# EAGLE design tk2 (EAGLE 8.4.3)

## Sheet 1 of 2
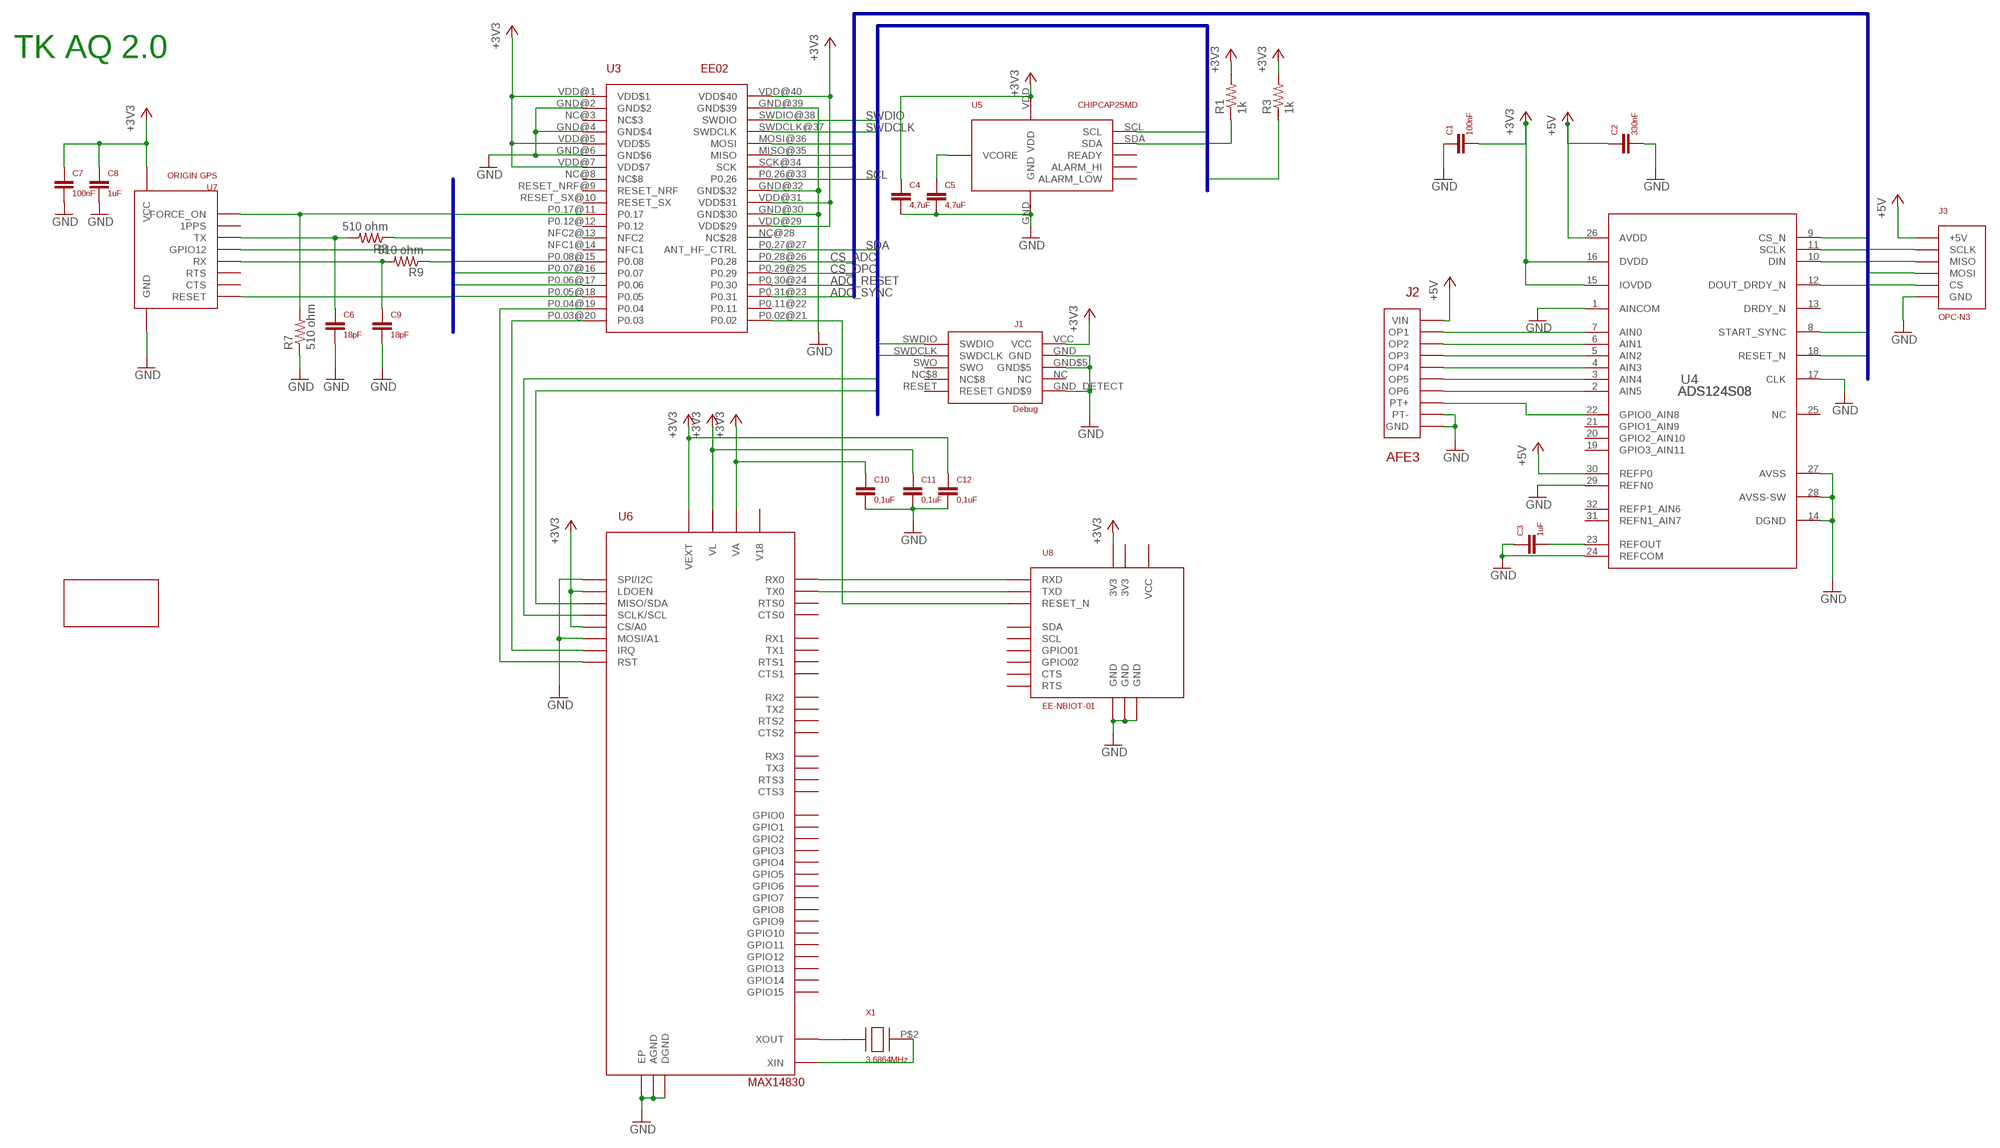
[diagram p0: schematic, sheet 1]

### Parts
C1  100nF  CAPACITOR_NONPOLAR0402  [0402]
C2  330nF  CAPACITOR_NONPOLAR0402  [0402]
C3  1uF  CAPACITOR_NONPOLAR0402  [0402]
C4  4,7uF  4.7UF-08050805  [0805]
C5  4,7uF  4.7UF-08050805  [0805]
C6  18pF  CAPACITOR_NONPOLAR0805  [0805]
C7  100nF  CAPACITOR_NONPOLAR0805  [0805]
C8  1uF  CAPACITOR_NONPOLAR0805  [0805]
C9  18pF  CAPACITOR_NONPOLAR0805  [0805]
C10  0,1uF  CAPACITOR_NONPOLAR0805  [0805]
C11  0,1uF  CAPACITOR_NONPOLAR0805  [0805]
C12  0,1uF  CAPACITOR_NONPOLAR0805  [0805]
J1  Debug  DEBUGHEADER  [NRF52-P19-CONNECTOR]
J2  AFE3_IDC_CABLE  [AFE3_IDC_CABLE]
J3  OPC_N3_CONNECTOR  [OPC_N3_CONNECTOR]
R1  1k  510OHM1/4W1%(0805)  [0805]
R3  1k  510OHM1/4W1%(0805)  [0805]
R7  510 ohm  510OHM1/4W1%(0805)  [0805]
R8  510 ohm  510OHM1/4W1%(0805)  [0805]
R9  510 ohm  510OHM1/4W1%(0805)  [0805]
U3  EE02  EE02_02  [EE02_02]
U4  ADS124S08  [PBS0032A_N]
U5  CHIPCAP2SMD  [CHIPCAP2]
U6  MAX14830  [MAX14830]
U7  ORIGIN GPS  ORIGIN_GPS_HORNET_1510  [ORIGIN_GPS_HORNET_1510]
U8  EE-NBIOT-01  [EE-NBIOT-01]
U$1  EE_TK_LOGO  [EE_TK_LOGO]
X1  CRYSTAL_HC49  [CRYSTAL_HC49]

### Nets
+3V3: C1.2 C4.1 C7.1 C8.1 C10.1 C11.1 C12.1 J1.VCC R1.2 R3.2 U3.VDD@1(VDD$1) U3.VDD@5(VDD$5) U3.VDD@7(VDD$7) U3.VDD@29(VDD$29) U3.VDD@31(VDD$31) U3.VDD@40(VDD$40) U4.15(IOVDD) U4.16(DVDD) U5.VDD U6.CS/A0 U6.LDOEN U6.VA U6.VEXT U6.VL U7.4_VCC(VCC) U8.3V3@3(3V3) ; also sheet 2
+5V: C2.1 J2.VIN J3.+5V U4.26(AVDD) U4.30(REFP0) ; also sheet 2
ADC_RESET: U3.P0.30@24(P0.30) U4.18(RESET_N)
ADC_SYNC: U3.P0.31@23(P0.31) U4.8(START_SYNC)
CS_ADC: U3.P0.28@26(P0.28) U4.9(CS_N)
CS_OPC: J3.CS U3.P0.29@25(P0.29)
FORCE_ON: R7.2 U3.P0.17@11(P0.17) U7.1_FORCE_ON(FORCE_ON)
GND: C1.1 C2.2 C3.1 C4.2 C5.2 C6.2 C7.2 C8.2 C9.2 C10.2 C11.2 C12.2 J1.GND J1.GND$5 J1.GND_DETECT(GND$9) J2.GND J2.PT- J3.GND R7.1 U3.GND@2(GND$2) U3.GND@4(GND$4) U3.GND@6(GND$6) U3.GND@30(GND$30) U3.GND@32(GND$32) U3.GND@39(GND$39) U4.1(AINCOM) U4.14(DGND) U4.17(CLK) U4.24(REFCOM) U4.27(AVSS) U4.28(AVSS-SW) U4.29(REFN0) U5.GND U6.AGND U6.DGND U6.EP U6.MOSI/A1 U6.SPI/I2C U7.5_GND(GND) U8.GND@2(GND) U8.GND@5(GND) U8.GND@6(GND) ; also sheet 2
MISO: J3.MISO U3.MISO@35(MISO) U4.12(DOUT_DRDY_N)
MOSI: J3.MOSI U3.MOSI@36(MOSI) U4.10(DIN)
N$2: C5.1 U5.VCORE
N$3: C3.2 U4.23(REFOUT)
N$4: U6.RX0 U8.RXD
N$5: U6.TX0 U8.TXD
N$7: C6.1 R8.2 U7.3_TX(TX)
N$8: C9.1 R9.2 U7.10_RX(RX)
N$11: J2.OP1 U4.7(AIN0)
N$12: J2.OP2 U4.6(AIN1)
N$13: J2.OP3 U4.5(AIN2)
N$15: J2.OP4 U4.4(AIN3)
N$17: U3.P0.03@20(P0.03) U6.IRQ
N$18: U3.P0.04@19(P0.04) U6.RST
N$19: U3.P0.02@21(P0.02) U8.RESET_N
N$21: U6.XOUT X1.P$1
N$22: U6.XIN X1.P$2
N$24: J2.OP5 U4.3(AIN4)
N$27: J2.OP6 U4.2(AIN5)
N$28: J2.PT+ U4.22(GPIO0_AIN8)
RESET: U3.P0.06@17(P0.06) U7.8_RESET(RESET)
RX: R9.1 U3.P0.07@16(P0.07)
SCL: R1.1 U3.P0.26@33(P0.26) U5.SCL U6.SCLK/SCL
SCLK: J3.SCLK U3.SCK@34(SCK) U4.11(SCLK)
SDA: R3.1 U3.P0.27@27(ANT_HF_CTRL) U5.SDA U6.MISO/SDA
SWDCLK: J1.SWDCLK U3.SWDCLK@37(SWDCLK)
SWDIO: J1.SWDIO U3.SWDIO@38(SWDIO)
TX: R8.1 U3.P0.08@15(P0.08)
WAKE_UP: U3.P0.05@18(P0.05) U7.6_GPIO12(GPIO12)
Unconnected: J1.NC J1.NC$8 J1.RESET J1.SWO U3.NC@3(NC$3) U3.NC@8(NC$8) U3.NC@28(NC$28) U3.NFC1@14(NFC1) U3.NFC2@13(NFC2) U3.P0.11@22(P0.11) U3.P0.12@12(P0.12) U3.RESET_NRF@9(RESET_NRF) U3.RESET_SX@10(RESET_SX) U4.13(DRDY_N) U4.19(GPIO3_AIN11) U4.20(GPIO2_AIN10) U4.21(GPIO1_AIN9) U4.25(NC) U4.31(REFN1_AIN7) U4.32(REFP1_AIN6) U5.ALARM_HI U5.ALARM_LOW U5.READY(I2C)(READY) U6.CTS0 U6.CTS1 U6.CTS2 U6.CTS3 U6.GPIO0 U6.GPIO1 U6.GPIO2 U6.GPIO3 U6.GPIO4 U6.GPIO5 U6.GPIO6 U6.GPIO7 U6.GPIO8 U6.GPIO9 U6.GPIO10 U6.GPIO11 U6.GPIO12 U6.GPIO13 U6.GPIO14 U6.GPIO15 U6.RTS0 U6.RTS1 U6.RTS2 U6.RTS3 U6.RX1 U6.RX2 U6.RX3 U6.TX1 U6.TX2 U6.TX3 U6.V18 U7.2_1PPS(1PPS) U7.7_CTS(CTS) U7.9_RTS(RTS) U8.3V3@4(3V3) U8.CTS U8.GPIO01 U8.GPIO02 U8.RTS U8.SCL U8.SDA U8.VCC

### Buses
SCL,SDA,SWDIO,SWDCLK,P1,P2
FORCE_ON,TX,RX,RESET,WAKE_UP
CS_ADC,CS_OPC,SCLK,MISO,MOSI,ADC_RESET,ADC_SYNC

### Notes on the sheet
- TK AQ 2.0

## Sheet 2 of 2
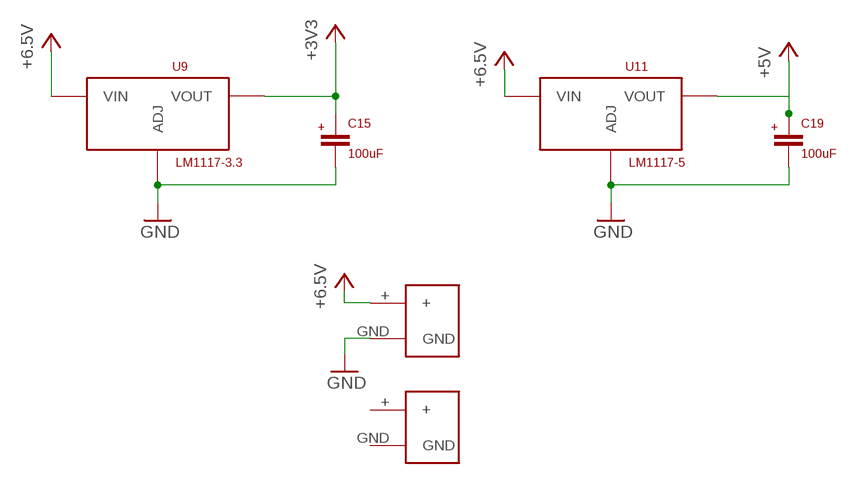
[diagram p1: schematic, sheet 2]

### Parts
C15  100uF  ELECTROLYTIC_CAPACITORWURTH_100  [ALUMINUM_WURTH_100UF_865080243007]
C19  100uF  ELECTROLYTIC_CAPACITORWURTH_100  [ALUMINUM_WURTH_100UF_865080243007]
U9  LM1117-3.3  LM1117  [LM1117]
U11  LM1117-5  LM1117  [LM1117]
U$2  PHOENIX_CONTACT_MSTBVA_2_5  [PHOENIX_CONTACT_MSTBVA_2_5]
U$3  PHOENIX_CONTACT_MSTBVA_2_5  [PHOENIX_CONTACT_MSTBVA_2_5]

### Nets
+3V3: C15.+ U9.VOUT$1(VOUT) U9.VOUT$2(VOUT) ; also sheet 1
+5V: C19.+ U11.VOUT$1(VOUT) U11.VOUT$2(VOUT) ; also sheet 1
+6.5V: U9.VIN U11.VIN U$2.+
GND: C15.- C19.- U9.GND(ADJ) U11.GND(ADJ) U$2.GND ; also sheet 1
Unconnected: U$3.+ U$3.GND

## Library data of the parts
C1-C3 C6-C12 = EE:CAPACITOR_NONPOLAR
C4 C5 = EE:4.7UF-0805
C15 C19 = EE:ELECTROLYTIC_CAPACITOR
J1 = EE:DEBUGHEADER: DEBUG HEADER
J2 = EE:AFE3_IDC_CABLE
J3 = EE:OPC_N3_CONNECTOR
R1 R3 = EE:510OHM1/4W1%(0805): 510 Ohm; VALUE: 510 ohm
R7-R9 = EE:510OHM1/4W1%(0805): 510 Ohm
U3 = EE:EE02_02
U4 = EE:ADS124S08
U5 = EE:CHIPCAP2
U6 = EE:MAX14830
U7 = EE:ORIGIN_GPS_HORNET_1510
U8 = EE:EE-NBIOT-01
U9 U11 = EE:LM1117
U$1 = EE:EE_TK_LOGO
U$2 U$3 = EE:PHOENIX_CONTACT_MSTBVA_2_5
X1 = EE:CRYSTAL_HC49

## Board
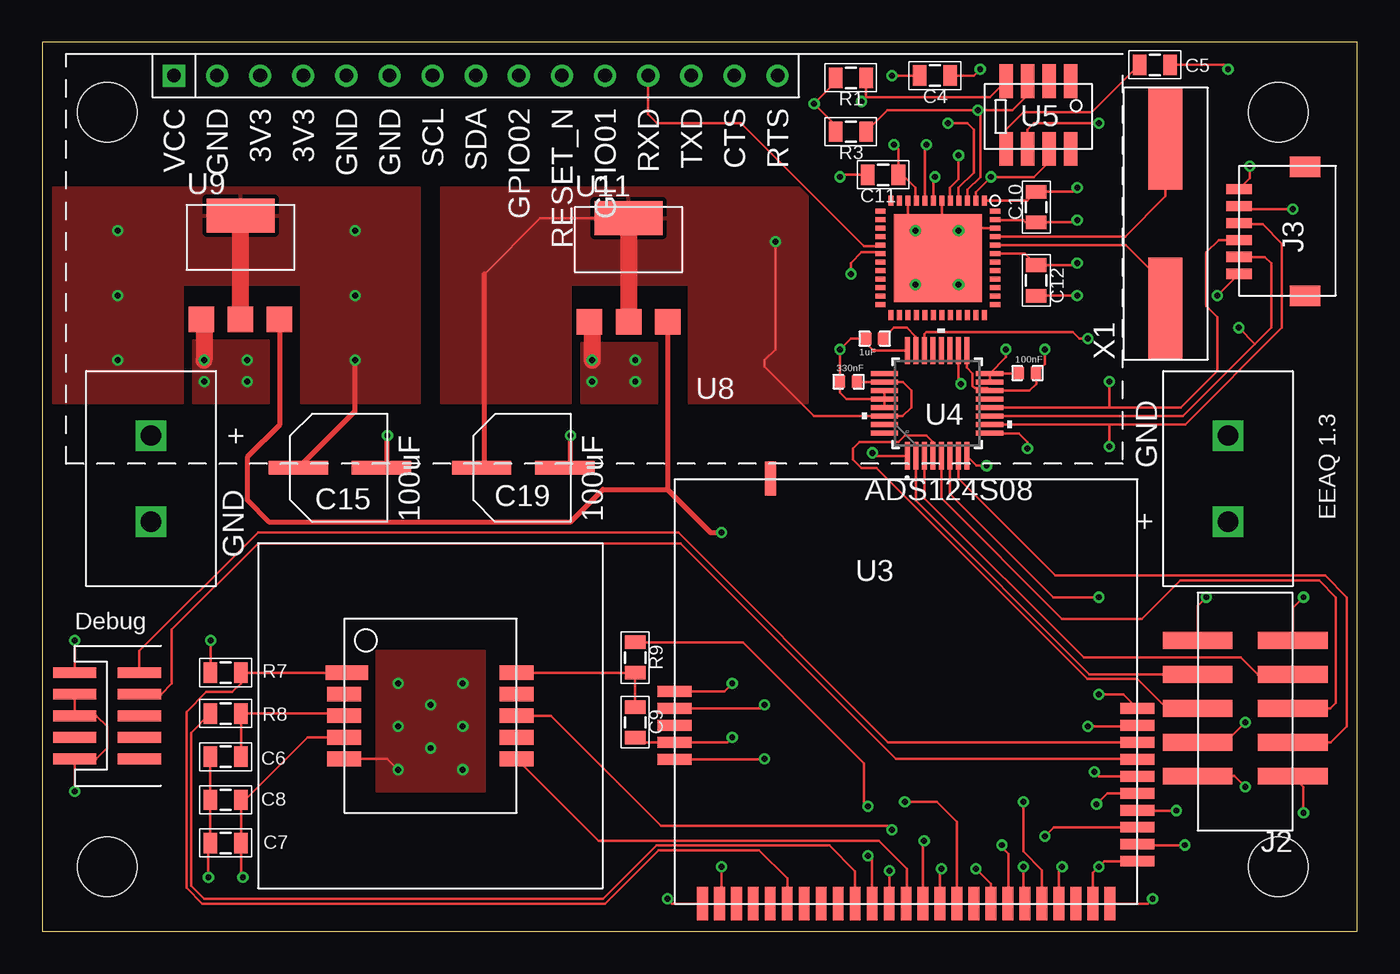
[diagram p2: board, top side]
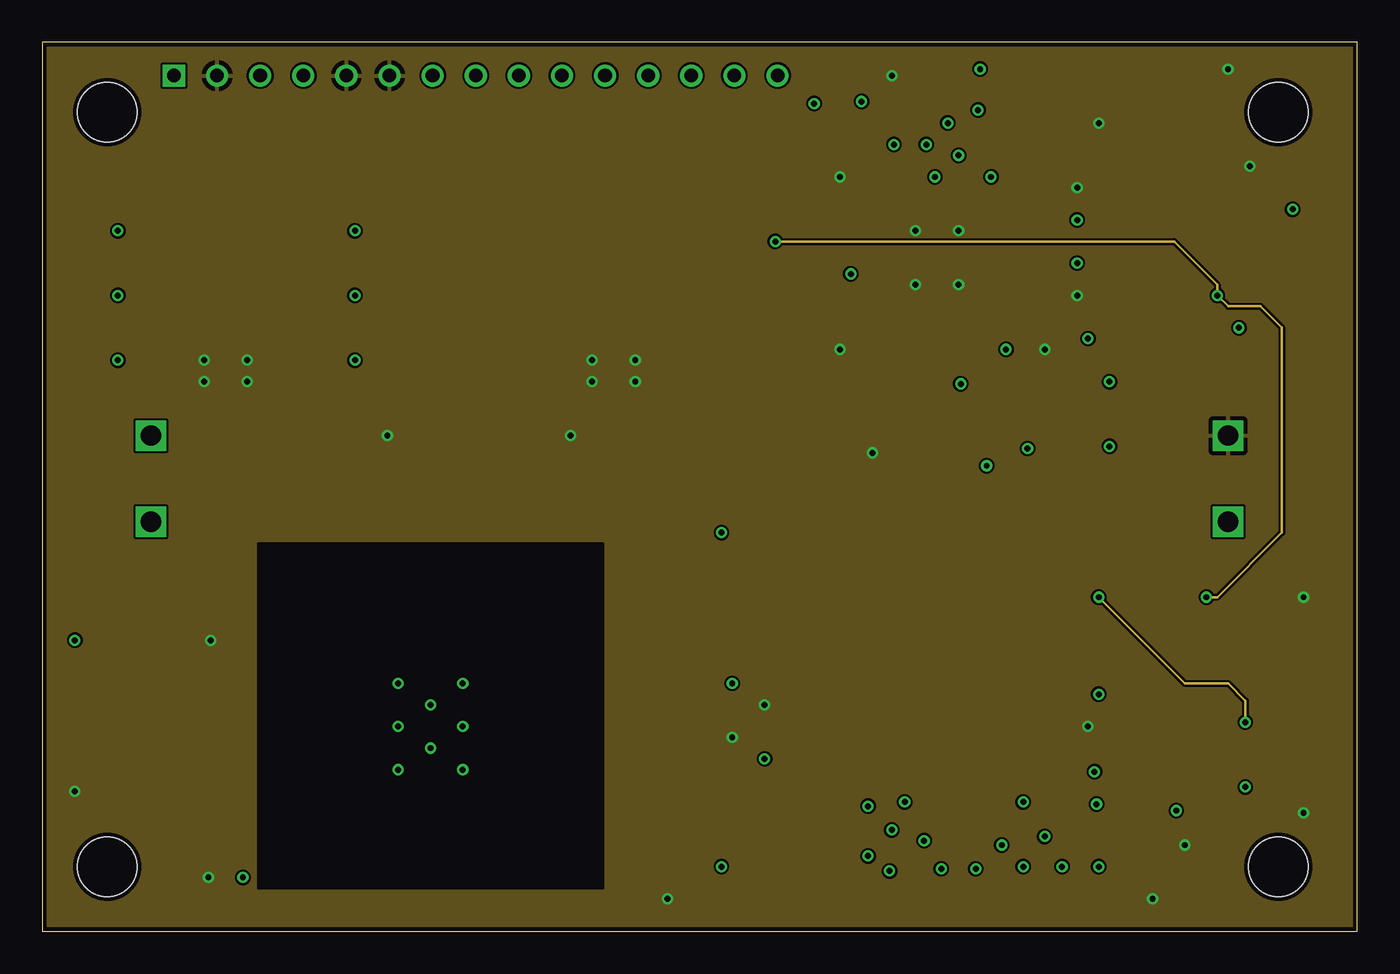
[diagram p3: board, inner layer GND]
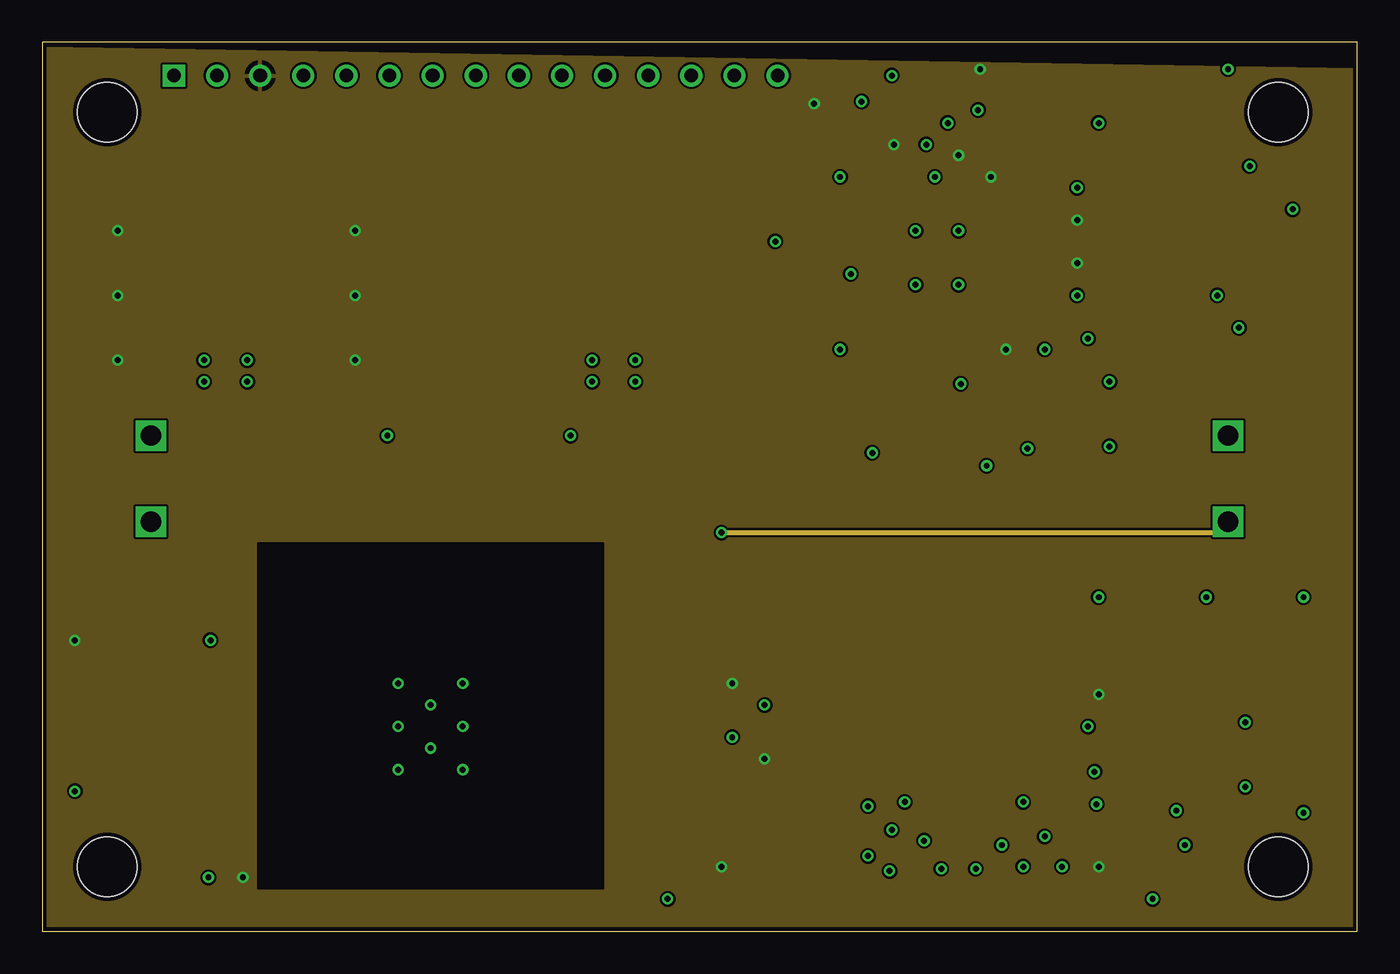
[diagram p4: board, inner layer +3V3]
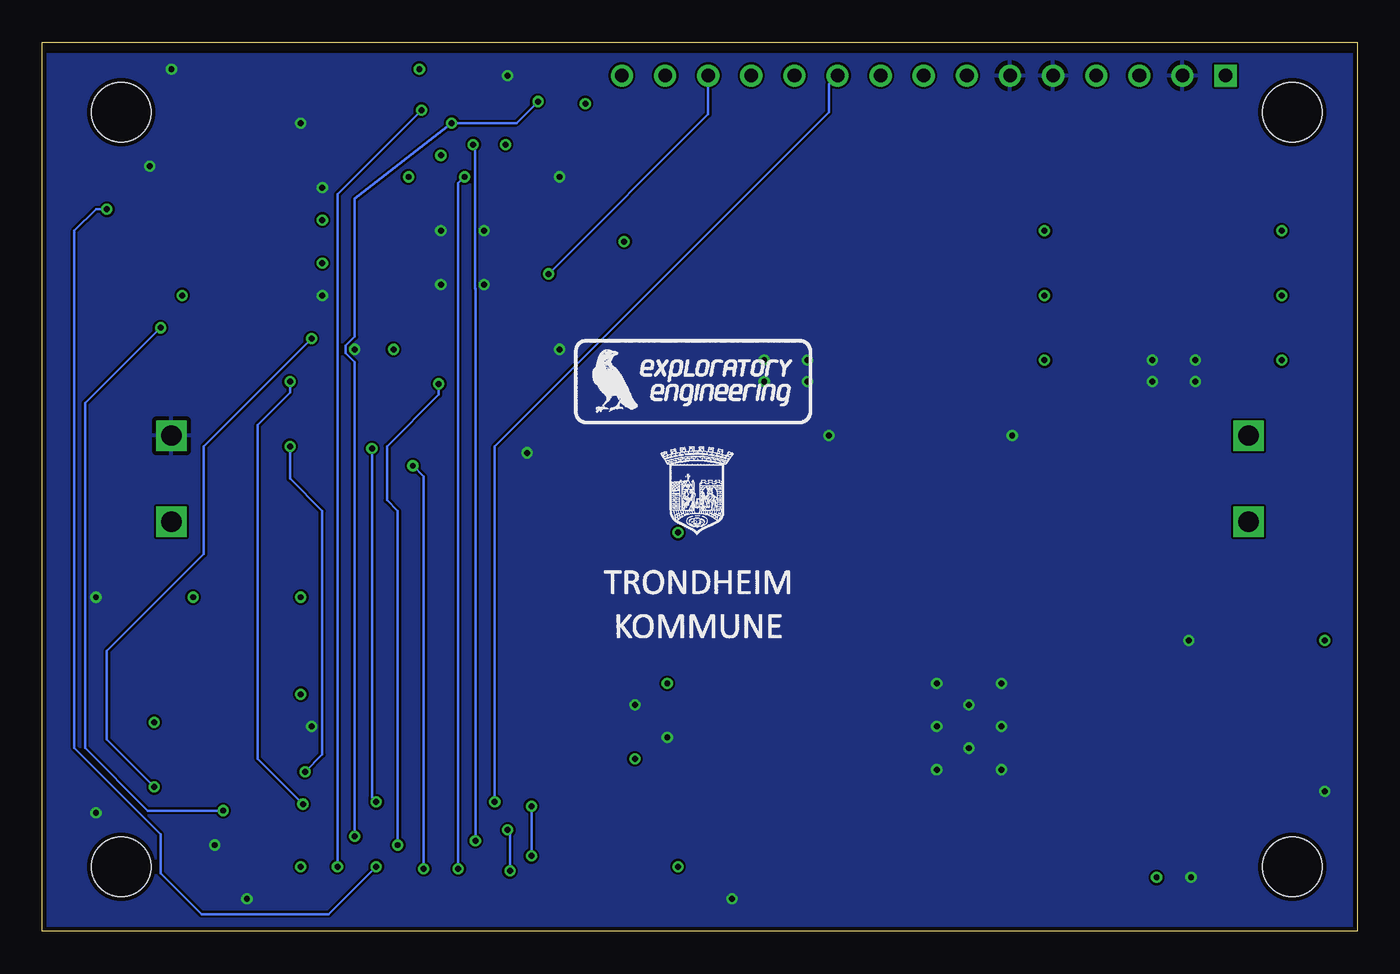
[diagram p5: board, bottom side, seen from below]

Size 77.45 x 52.38 mm. Coordinates in mm from the lower left corner, seen from the top.
Outline: 0,0 77.45,0 77.45,52.38 0,52.38 0,0
Copper layers (1*2*15*16): Top 0.035mm / dielectric 0.2mm / GND 0.0175mm / dielectric 1.2mm / +3V3 0.0175mm / dielectric 0.2mm / Bottom 0.035mm
Design rules "dirtypcbs_4_layer": minimum track width 5mil, minimum drill 12mil, track to track 5mil, track to pad 5mil, pad to pad 5mil, via to via 5mil, smd to smd 0mil, copper to edge 10mil, drill to drill 10mil, minimum pad ring 10mil, minimum via ring 6mil, stop-mask expansion 2mil, vias tented up to drill 25mil, thermal gap 10mil
Holes 3.5 mm at 3.81,48.26 3.81,3.81 72.81,48.26 72.81,3.81

### Footprints (pad centres in the part's own frame; a part is rotated, then mirrored left to right if it is on the bottom)
0402 = smd 0.6 x 0.7: 1 0,0; 2 1,0
0805 = smd 0.8 x 1.2: 1 -0.9,0; 2 0.9,0
ALUMINUM_WURTH_100UF_865080243007 = smd 0.8 x 3.5: + 0,0.8; - 0,-4.1
NRF52-P19-CONNECTOR = smd 2.54 x 0.635: GND -2.54,5.08; GND$5 -2.54,3.81; GND_DETECT -2.54,1.27; NC -2.54,2.54; NC$8 1.27,2.54; RESET 1.27,1.27; SWDCLK 1.27,5.08; SWDIO 1.27,6.35; SWO 1.27,3.81; VCC -2.54,6.35
AFE3_IDC_CABLE = smd 4.1 x 1: GND 0,0; OP1 0,6; OP2 5.6,6; OP3 0,4; OP4 5.6,4; OP5 0,2; OP6 5.6,2; PT+ 5.6,8; PT- 0,8; VIN 5.6,0
OPC_N3_CONNECTOR = smd 0.6 x 1.5: +5V 0,0; CS 4,0; GND 5,0; MISO 2,0; MOSI 3,0; SCLK 1,0 | smd 1.2 x 1.8: GND@7 -1.3,-3.9; GND@8 6.3,-3.9
EE02_02 = smd 0.635 x 2: EXT_ANT 4.01,25.035; GND@6 0,0; GND@30 24,0; NC@8 2,0; NC@28 22,0; NFC1@14 8,0; NFC2@13 7,0; P0.02@21 15,0; P0.03@20 14,0; P0.04@19 13,0; P0.05@18 12,0; P0.06@17 11,0; P0.07@16 10,0; P0.08@15 9,0; P0.11@22 16,0; P0.12@12 6,0; P0.17@11 5,0; P0.27@27 21,0; P0.28@26 20,0; P0.29@25 19,0; P0.30@24 18,0; P0.31@23 17,0; RESET_NRF@9 3,0; RESET_SX@10 4,0; VDD@7 1,0; VDD@29 23,0 | smd 2 x 0.635: GND@2 -1.635,11.5; GND@4 -1.635,9.5; GND@32 25.635,3.5; GND@39 25.635,10.5; MISO@35 25.635,6.5; MOSI@36 25.635,7.5; NC@3 -1.635,10.5; P0.26@33 25.635,4.5; SCK@34 25.635,5.5; SWDCLK@37 25.635,8.5; SWDIO@38 25.635,9.5; VDD@1 -1.635,12.5; VDD@5 -1.635,8.5; VDD@31 25.635,2.5; VDD@40 25.635,11.5
PBS0032A_N = smd 1.6 x 0.305: 1 -3.1,1.75; 2 -3.1,1.25; 3 -3.1,0.75; 4 -3.1,0.25; 5 -3.1,-0.25; 6 -3.1,-0.75; 7 -3.1,-1.25; 8 -3.1,-1.75; 17 3.1,-1.75; 18 3.1,-1.25; 19 3.1,-0.75; 20 3.1,-0.25; 21 3.1,0.25; 22 3.1,0.75; 23 3.1,1.25; 24 3.1,1.75 | smd 0.305 x 1.6: 9 -1.75,-3.1; 10 -1.25,-3.1; 11 -0.75,-3.1; 12 -0.25,-3.1; 13 0.25,-3.1; 14 0.75,-3.1; 15 1.25,-3.1; 16 1.75,-3.1; 25 1.75,3.1; 26 1.25,3.1; 27 0.75,3.1; 28 0.25,3.1; 29 -0.25,3.1; 30 -0.75,3.1; 31 -1.25,3.1; 32 -1.75,3.1
CHIPCAP2 = smd 2 x 0.8: ALARM_HI 0,0; ALARM_LOW 4,0; GND 0,2.54; READY(I2C) 4,1.27; SCL 4,3.81; SDA 4,2.54; VCORE 0,3.81; VDD 0,1.27
MAX14830 = smd 0.6 x 0.3: AGND -0.625,1.625; CTS0 6.125,2.125; CTS1 6.125,6.125; CTS3 -0.625,4.625; GPIO2 6.125,0.625; GPIO3 6.125,1.125; GPIO4 6.125,3.625; GPIO5 6.125,4.125; GPIO6 6.125,4.625; GPIO7 6.125,5.125; GPIO14 -0.625,6.125; GPIO15 -0.625,5.625; RTS0 6.125,1.625; RTS1 6.125,5.625; RTS3 -0.625,5.125; RX0 6.125,2.625; RX3 -0.625,4.125; TX0 6.125,3.125; TX3 -0.625,3.625; V18 -0.625,0.625; VA -0.625,1.125; VEXT -0.625,3.125; XIN -0.625,2.125; XOUT -0.625,2.625 | smd 0.3 x 0.6: CS/A0 2,0; CTS2 2,6.75; DGND 4.5,0; GPIO0 5,0; GPIO1 5.5,0; GPIO8 4.5,6.75; GPIO9 4,6.75; GPIO10 3.5,6.75; GPIO11 3,6.75; GPIO12 0.5,6.75; GPIO13 0,6.75; IRQ 3,0; LDOEN 0.5,0; MISO/SDA 1,0; MOSI/A1 2.5,0; RST 3.5,0; RTS2 2.5,6.75; RX1 5.5,6.75; RX2 1.5,6.75; SCLK/SCL 1.5,0; SPI/I2C 0,0; TX1 5,6.75; TX2 1,6.75; VL 4,0 | smd 5.18 x 5.18: EP 2.75,3.375
ORIGIN_GPS_HORNET_1510 = smd 2.5 x 0.864: 1_FORCE_ON 10,0 | smd 2 x 0.864: 2_1PPS 10.16,1.27; 3_TX 10.16,2.54; 4_VCC 10.16,3.81; 5_GND 10.16,5.08; 6_GPIO12 0,5.08; 7_CTS 0,3.81; 8_RESET 0,2.54; 9_RTS 0,1.27; 10_RX 0,0
EE-NBIOT-01 = drill 0.8: 3V3@3 -5.08,0; 3V3@4 -7.62,0; CTS -33.02,0; GND@2 -2.54,0; GND@5 -10.16,0; GND@6 -12.7,0; GPIO01 -25.4,0; GPIO02 -20.32,0; RESET_N -22.86,0; RTS -35.56,0; RXD -27.94,0; SCL -15.24,0; SDA -17.78,0; TXD -30.48,0 | drill 0.8 square: VCC 0,0
LM1117 = smd 1.5 x 1.5: GND -2.3,-6.1; VIN 2.3,-6.1; VOUT$2 0,-6.1 | smd 4 x 2: VOUT$1 0,0
PHOENIX_CONTACT_MSTBVA_2_5 = drill 1.2 square: + -2.54,0; GND 2.54,0
CRYSTAL_HC49 = smd 6 x 2: P$1 0,0; P$2 10,0

### Placement (x,y rotation side)
C1  58.53,32.89 180 top
C2  47.99,32.38 180 top
C3  48.53,34.92 0 top
C4  52.58,50.42 180 top
C5  65.53,51.05 0 top
C6  10.79,10.29 180 top
C7  10.79,5.21 180 top
C8  10.79,7.75 180 top
C9  34.92,12.32 270 top
C10  58.55,42.67 90 top
C11  49.53,44.58 180 top
C12  58.55,38.35 270 top
C15  15.88,27.3 90 top
C19  26.67,27.3 90 top
J1  4.45,8.89 0 top
J2  73.66,17.14 180 top
J3  70.48,38.73 90 top
R1  47.62,50.29 180 top
R3  47.62,47.12 180 top
R7  10.79,15.24 0 top
R8  10.79,12.83 0 top
R9  34.92,16.13 270 top
U3  38.88,1.64 0 top
U4  52.7,31.11 90 top
U5  60.58,46.1 90 top
U6  55.5,43.05 180 top
U7  27.94,15.24 180 top
U8  7.75,50.42 180 top
U9  11.67,42.16 0 top
U11  34.53,42.02 0 top
U$1  48.9,15.37 0 bottom
U$2  69.85,26.67 90 top
U$3  6.4,26.67 270 top
X1  66.17,36.7 90 top

### Tracks (layer width: path | path; a pad name or v marks a point on that pad's centre or on a via)
+3V3  (via drill 0.35)
  Top 0.152: J1.VCC v1.91,17.14 | U3.VDD@1 40.17,14.13 v40.64,14.61 | U3.VDD@5 42.52,10.13 v42.55,10.16 | v40.01,3.81 40.01,1.76 U3.VDD@7 | U3.VDD@29 61.88,3.46 v62.23,3.81 62.55,4.13 U3.VDD@31 | U3.VDD@40 63.68,13.97 v62.23,13.97 | U6.VA 56.14,41.91 57.78,41.91 57.92,41.77 C10.1 60.82,41.77 v60.96,41.91 | U6.VEXT 57.87,39.93 C12.1 60.84,39.25 v60.96,39.37 | R1.2 46.73,50.03 v45.47,48.77 46.73,47.51 R3.2 | C4.1 54.86,50.42 v55.24,50.8 | U6.LDOEN 54.99,43.56 v55.88,44.45 58.42,44.45 59.31,45.34 U5.VDD | v50.16,46.35 50.43,46.09 C11.1 50.67,44.58 51.44,43.81 51.44,43.12 U6.VL | U7.4_VCC 15.62,11.43 11.94,7.75 C8.1 C7.1 11.7,3.29 v11.81,3.17 | U4.16 56.77,33.83 v56.77,34.29 | C1.2 57.5,32.87 U4.16 | U4.15 U4.16 | U6.CS/A0 53.47,43.09 53.47,43.81 53.98,44.32 v53.98,45.72
  Top 0.3: C15.+ 18.41,30.64 v18.41,33.66
  Top 1: U9.VOUT$2 U9.VOUT$1
  other vias: 4.45,41.27 4.45,37.47 4.45,33.66 18.41,41.27 18.41,37.47
  pour +3V3 (rank 2): 0,0 0,52.07 77.47,50.8 77.47,-1.27
  pour Top: 0.64,43.81 0.64,31.11 8.26,31.11 8.26,38.1 15.24,38.1 15.24,31.11 22.23,31.11 22.23,43.81
+5V  (via drill 0.35)
  Top 0.152: C19.+ 26.04,27.47 | 26.04,38.73 29.32,42.02 U11.VOUT$1 | J2.VIN 68.06,19.16 v68.58,19.68 | J3.+5V v69.22,37.47 | v43.18,40.64 43.18,34.29 42.55,33.66 42.55,33.27 45.47,30.35 U4.30 49.62,30.35 50.67,30.35 51.18,30.86 51.18,31.88 50.69,32.37 U4.26 48.01,32.37 C2.1
  Top 0.3: 26.04,27.47 26.04,38.73
  Top 1: U11.VOUT$1 U11.VOUT$2
  GND 0.152: v43.18,40.64 66.67,40.64 69.22,38.1 v69.22,37.47 69.85,36.83 71.75,36.83 73.03,35.56 73.03,23.5 69.22,19.68 v68.58,19.68
  pour Top: 38.1,31.11 38.1,38.1 31.11,38.1 31.11,31.11 23.5,31.11 23.5,43.81 45.09,43.81 45.09,31.11
+6.5V  (via drill 0.35)
  Top 0.152: 14.1,35.93 U9.VIN
  Top 0.3: U11.VIN 36.83,26.04 | U9.VIN 13.97,29.84 12.06,27.94 12.06,25.4 13.34,24.13 31.11,24.13 33.02,26.04 36.83,26.04 | 36.83,26.04 39.37,23.5 v40.01,23.5
  +3V3 0.3: v40.01,23.5 69.22,23.5 U$2.+
ADC_RESET  (via drill 0.35)
  Top 0.152: U3.P0.30@24 56.77,1.75 56.9,1.87 56.9,4.57 56.52,4.95 v56.52,5.08 | v54.1,32.26 53.95,32.41 U4.18
  Bottom 0.152: v54.1,32.26 54.1,31.62 57.15,28.57 57.15,25.4 56.52,24.77 v56.52,5.08
ADC_SYNC  (via drill 0.35)
  Top 0.152: 56.01,1.76 U3.P0.31@23 55.88,2.79 v54.99,3.68 | U4.8 55.04,27.43 v55.63,27.43
  Bottom 0.152: v55.63,27.43 54.99,26.8 v54.99,3.68
CS_ADC  (via drill 0.35)
  Top 0.152: U3.P0.28@26 58.88,3.6 57.78,4.7 v57.78,7.62 | U4.9 55.83,29.34 57.53,29.34 58.04,28.83 v58.04,28.45
  Bottom 0.152: v58.04,28.45 58.04,7.87 v57.78,7.62
CS_OPC  (via drill 0.35)
  Top 0.152: J3.CS 70.67,42.55 v73.66,42.55 | U3.P0.29@25 57.78,1.73 v57.78,3.81
  Bottom 0.152: v57.78,3.81 60.58,1.02 68.07,1.02 70.48,3.43 70.48,5.71 75.56,10.79 75.56,41.27 74.3,42.55 v73.66,42.55
FORCE_ON
  Top 0.152: U7.1_FORCE_ON R7.2 11.7,14.62 11.18,14.1 9.65,14.1 8.48,12.93 8.48,2.55 9.41,1.63 33.14,1.63 36.28,4.78 42.22,4.78 43.88,3.11 U3.P0.17@11
GND  (via drill 0.35)
  Top 0.152: U9.GND 9.53,35.91 | U11.GND 32.38,35.77 | C15.- 20.32,27.65 | C19.- 31.11,27.65 | v1.91,8.26 J1.GND_DETECT 3.17,10.16 3.81,10.79 3.81,12.06 3.17,12.7 J1.GND$5 J1.GND | U3.GND@2 42.34,13.13 v42.55,13.34 | v40.64,11.43 40.34,11.13 U3.GND@4 35.21,11.13 C9.2 | v36.83,1.91 37.1,1.64 U3.GND@6 | U3.GND@30 65.14,1.64 v65.41,1.91 | U3.GND@32 64.57,5.08 v67.31,5.08 | U3.GND@39 64.45,12.06 v61.59,12.06 | J2.PT- 74.3,8.51 v74.3,6.99 | v71.12,45.09 71.12,44.37 J3.GND | v60.96,43.81 60.72,43.57 C10.2 58.03,43.05 U6.SPI/I2C | C12.2 60.95,37.45 v60.96,37.47 | C4.2 v50.04,50.42 | v69.85,50.8 69.6,51.05 C5.2 | v46.99,44.45 47.12,44.58 C11.2 | U6.DGND 51,41.71 v51.44,41.27 | U6.AGND 54.13,41.43 v53.98,41.27 53,42.25 U6.MOSI/A1 | U4.24 48.97,34.22 48.53,34.66 C3.1 47.62,34.92 v46.99,34.29 C2.2 46.99,31.75 47.38,31.36 U4.28 | U7.5_GND 20.32,10.16 v20.95,9.53 | J2.GND 73.66,19.05 v74.3,19.68 | U4.27 U4.28 | U4.28 U4.29 | C7.2 C8.2 C6.2 | v9.91,17.14 9.91,15.25 R7.1 | C7.2 9.89,4.71 | v9.78,3.17 9.78,5.09 C7.2 | v59.05,34.29 59.05,33.42 C1.1 58.55,32.88 58.55,32.26 58.15,31.86 U4.14 55.66,32.01 54.92,32.01 54.8,32.13 54.8,32.87 54.45,33.22 U4.17 | U5.GND 58.04,47.24 58.42,47.62 v62.23,47.62 | U6.EP 53.98,38.45 v53.98,38.1 | U4.1 49.07,28.02 v48.9,28.19
  Top 0.3: 20.32,27.65 v20.32,29.21 | 31.11,27.65 v31.11,29.21
  Top 1: 9.53,35.91 v9.53,33.66 | 32.38,35.77 v32.38,33.66
  other vias: 9.53,32.38 12.06,33.66 12.06,32.38 32.38,32.38 34.92,33.66 34.92,32.38 24.77,9.53 24.77,12.06 24.77,14.61 22.86,10.79 22.86,13.34 20.95,12.06 20.95,14.61 51.44,38.1
  pour GND (rank 2): 0,0 0,52.07 77.47,52.07 77.47,0
  pour Bottom (rank 2): 0,0 0,51.69 77.47,51.69 77.47,0
  pour Top: 26.04,8.26 26.04,16.51 19.68,16.51 19.68,8.26
  pour Top: 8.89,34.8 8.89,31.11 13.34,31.11 13.34,34.8
  pour Top: 31.75,34.67 31.75,31.11 36.2,31.11 36.2,34.67
MISO  (via drill 0.35)
  Top 0.152: 62.87,30.86 U4.12 | 62.87,30.86 67.06,30.86 69.22,33.02 69.22,36.2 68.58,36.83 68.58,40.01 69.31,40.73 J3.MISO | v62.87,32.38 62.87,30.86 | U3.MISO@35 62.74,8.13 v62.1,7.49
  Bottom 0.152: v62.1,7.49 64.77,10.16 64.77,29.84 62.87,31.75 v62.87,32.38
MOSI  (via drill 0.35)
  Top 0.152: 62.87,29.86 U4.10 | 62.87,29.86 67.33,29.86 73.03,35.56 73.03,40.51 71.88,41.66 70.56,41.66 J3.MOSI | v62.87,28.57 62.87,29.86 | U3.MOSI@36 62.24,9.13 v61.98,9.4
  Bottom 0.152: v61.98,9.4 60.96,10.41 60.96,24.77 62.87,26.67 v62.87,28.57
N$2
  Top 0.152: 56.77,47.12 U5.VCORE 56.77,47.24 57.78,48.26 61.84,48.26 C5.1
N$3
  Top 0.152: U4.23 51.44,34.23 51.44,35.05 50.93,35.56 50.16,35.56 C3.2
N$4
  Top 0.152: U6.RX0 49.33,40.39 48.39,40.39 41.15,47.62 36.2,47.62 35.69,48.13 U8.RXD
N$5  (via drill 0.35)
  Top 0.152: U6.TX0 49.3,40.01 48.26,40.01 47.62,39.37 v47.62,38.73
  Bottom 0.152: U8.TXD 38.23,48.13 v47.62,38.73
N$7
  Top 0.152: 17.65,12.83 U7.3_TX 17.65,12.83 | 17.65,12.83 R8.2 C6.1
N$8
  Top 0.152: 27.95,15.23 U7.10_RX 27.95,15.23 | 34.94,15.24 R9.2 | 27.95,15.23 R9.2 | R9.2 C9.1
N$9
  cutout GND: 12.7,2.54 12.7,22.86 33.02,22.86 33.02,2.54
N$11
  Top 0.152: 53.98,28 U4.7 53.95,26.69 59.69,20.95 75.56,20.95 76.83,19.68 76.83,12.06 75.92,11.14 J2.OP1
N$12  (via drill 0.35)
  Top 0.152: U4.6 53.47,28 53.47,25.78 59.56,19.68 v62.23,19.68 | v70.87,12.32 69.69,11.14 J2.OP2
  GND 0.152: v62.23,19.68 67.31,14.61 69.85,14.61 70.87,13.59 v70.87,12.32
N$13
  Top 0.152: U4.5 52.96,25.53 60.07,18.41 64.77,18.41 67.03,20.68 75.21,20.68 76.2,19.68 76.2,13.46 75.88,13.14 J2.OP3
N$14
  cutout +3V3: 33.02,2.54 33.02,22.86 12.7,22.86 12.7,2.54
N$15
  Top 0.152: U4.4 52.45,28.83 52.07,29.21 50.8,29.21 50.42,28.83 48.13,28.83 47.75,28.45 47.75,27.81 48.26,27.3 49.13,27.3 61.57,14.87 64.51,14.87 66.23,13.14 J2.OP4
N$17  (via drill 0.35)
  Top 0.152: U6.IRQ 52.5,44.37 v52.58,44.45 | U3.P0.03@20 52.88,3.6 v52.96,3.68
  Bottom 0.152: v52.96,3.68 52.96,44.07 v52.58,44.45
N$18  (via drill 0.35)
  Top 0.152: U6.RST 52,46.28 v52.07,46.35 | U3.P0.04@19 51.88,5.27 v51.94,5.33
  Bottom 0.152: v51.94,5.33 51.94,37.86 51.97,37.88 51.97,46.25 v52.07,46.35
N$19  (via drill 0.35)
  Top 0.152: U3.P0.02@21 53.88,6.44 52.7,7.62 v50.8,7.62
  Bottom 0.152: v50.8,7.62 50.8,28.57 31.11,48.26 31.11,49.91 U8.RESET_N
N$21
  Top 0.152: U6.XOUT 63.84,40.43 66.17,38.1 X1.P$1
N$22
  Top 0.152: U6.XIN 63.79,40.93 66.17,43.31 X1.P$2
N$24
  Top 0.152: U4.3 51.95,25.52 61.34,16.13 70.61,16.13 71.6,15.14 J2.OP5
N$27
  Top 0.152: U4.2 51.45,25.38 61.69,15.14 J2.OP6
N$28  (via drill 0.35)
  Top 0.152: U4.22 51.95,35.19 52.07,35.31 60.71,35.31 61.09,34.92 v61.59,34.92 | J2.PT+ 70.23,9.14 v70.87,8.51
  Bottom 0.152: v61.59,34.92 67.94,28.57 67.94,22.23 73.66,16.51 73.66,11.3 v70.87,8.51
RESET  (via drill 0.35)
  Top 0.152: U7.8_RESET 29.97,12.7 36.45,6.22 49.78,6.22 v50.04,5.97 | U3.P0.06@17 49.91,1.67 v49.91,3.56
  Bottom 0.152: v49.91,3.56 49.91,5.84 v50.04,5.97
RX  (via drill 0.35)
  Top 0.152: R9.1 41.26,17.03 48.39,9.91 48.39,7.62 v48.64,7.37 | U3.P0.07@16 48.88,4.21 v48.64,4.45
  Bottom 0.152: v48.64,7.37 v48.64,4.45
SCL  (via drill 0.35)
  Top 0.152: U6.SCLK/SCL 53.98,43.08 53.98,43.81 54.86,44.7 54.86,47.24 54.48,47.62 v53.34,47.62 | R1.1 48.52,49.16 v48.26,48.9 48.51,49.15 55.82,49.15 U5.SCL | U3.P0.26@33 59.6,6.13 v59.05,5.59
  Bottom 0.152: v48.26,48.9 49.53,47.62 v53.34,47.62 59.05,43.18 59.05,35.04 59.59,34.51 59.59,34.07 59.05,33.54 v59.05,5.59
SCLK  (via drill 0.35)
  Top 0.152: U4.11 67.19,30.36 71.44,34.61 | 71.44,34.61 72.39,35.56 72.39,39.37 72.03,39.73 J3.SCLK | v70.48,35.56 71.44,34.61 | U3.SCK@34 64.54,7.11 v66.8,7.11
  Bottom 0.152: v66.8,7.11 71.25,7.11 74.93,10.79 74.93,31.11 v70.48,35.56
SDA  (via drill 0.35)
  Top 0.152: R3.1 49.8,48.39 v55.12,48.39 | U5.SDA 58.04,49.28 57.15,48.39 v55.12,48.39 | 54.48,43.07 U6.MISO/SDA 54.5,43.7 55.24,44.45 55.24,48.13 55.12,48.26 v55.12,48.39 | U3.P0.27@27 59.88,3.62 v60.07,3.81
  Bottom 0.152: v60.07,3.81 60.07,43.43 v55.12,48.39
SWDCLK
  Top 0.152: J1.SWDCLK 6.99,13.97 7.62,14.61 7.62,17.78 12.7,22.86 37.59,22.86 50.29,10.16 64.49,10.16 U3.SWDCLK@37
SWDIO
  Top 0.152: J1.SWDIO 5.71,16.51 12.7,23.5 37.47,23.5 49.83,11.13 U3.SWDIO@38
TX
  Top 0.152: R8.1 8.76,11.7 8.76,2.67 9.53,1.91 33.02,1.91 36.17,5.05 46.35,5.05 47.88,3.53 U3.P0.08@15
WAKE_UP
  Top 0.152: U7.6_GPIO12 32.77,5.33 49.28,5.33 50.93,3.68 50.93,1.68 U3.P0.05@18

### Text on the board
tPlace: EEAQ 1.3